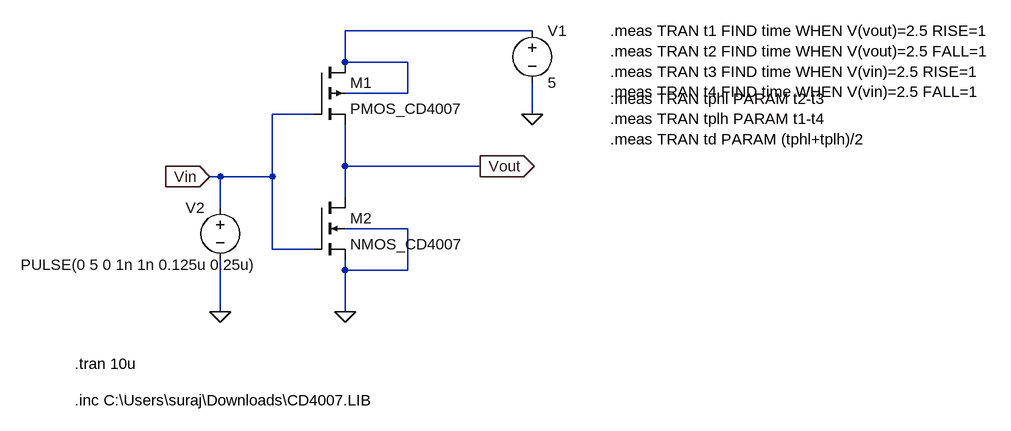
[diagram p0: schematic CD4007_INVERTER.asc]
CD4007_INVERTER.asc, the LTspice schematic file:
Version 4
SHEET 1 1072 680
WIRE 464 16 176 16
WIRE 176 64 176 16
WIRE 272 64 176 64
WIRE 272 112 272 64
WIRE 272 112 176 112
WIRE 128 144 64 144
WIRE 464 144 464 96
WIRE 176 224 176 160
WIRE 384 224 176 224
WIRE -16 240 -32 240
WIRE 64 240 64 144
WIRE 64 240 -16 240
WIRE 176 272 176 224
WIRE -16 288 -16 240
WIRE 272 320 176 320
WIRE 64 352 64 240
WIRE 128 352 64 352
WIRE 176 384 176 368
WIRE 272 384 272 320
WIRE 272 384 176 384
WIRE -16 448 -16 368
WIRE 176 448 176 384
FLAG 176 448 0
FLAG 384 224 Vout
IOPIN 384 224 Out
FLAG 464 144 0
FLAG -32 240 Vin
IOPIN -32 240 In
FLAG -16 448 0
SYMBOL pmos4 128 64 R0
SYMATTR InstName M1
SYMATTR Value PMOS_CD4007
SYMATTR Value2 l=5u w=360u
SYMBOL nmos4 128 272 R0
SYMATTR InstName M2
SYMATTR Value NMOS_CD4007
SYMATTR Value2 l=5u w=170u
SYMBOL voltage 464 0 R0
WINDOW 123 0 0 Left 0
WINDOW 39 0 0 Left 0
SYMATTR InstName V1
SYMATTR Value 5
SYMBOL voltage -16 272 M0
WINDOW 3 307 104 Right 2
WINDOW 123 0 0 Left 0
WINDOW 39 0 0 Left 0
SYMATTR Value PULSE(0 5 0 1n 1n 0.125u 0.25u)
SYMATTR InstName V2
TEXT -240 584 Left 2 !.inc C:\\Users\\suraj\\Downloads\\CD4007.LIB
TEXT 584 16 Left 2 !.meas TRAN t1 FIND time WHEN V(vout)=2.5 RISE=1\n.meas TRAN t2 FIND time WHEN V(vout)=2.5 FALL=1\n.meas TRAN t3 FIND time WHEN V(vin)=2.5 RISE=1\n.meas TRAN t4 FIND time WHEN V(vin)=2.5 FALL=1
TEXT 584 120 Left 2 !.meas TRAN tphl PARAM t2-t3\n.meas TRAN tplh PARAM t1-t4\n.meas TRAN td PARAM (tphl+tplh)/2
TEXT -240 528 Left 2 !.tran 10u

The netlist it stands for:
* CD4007_INVERTER.asc
M1 N001 Vin Vout N001 PMOS_CD4007 l=5u w=360u
M2 Vout Vin 0 0 NMOS_CD4007 l=5u w=170u
V1 N001 0 5
V2 Vin 0 PULSE(0 5 0 1n 1n 0.125u 0.25u)
.model NMOS NMOS
.model PMOS PMOS
.lib standard.mos
.inc C:\Users\suraj\Downloads\CD4007.LIB
.meas TRAN t1 FIND time WHEN V(vout)=2.5 RISE=1
.meas TRAN t2 FIND time WHEN V(vout)=2.5 FALL=1
.meas TRAN t3 FIND time WHEN V(vin)=2.5 RISE=1
.meas TRAN t4 FIND time WHEN V(vin)=2.5 FALL=1
.meas TRAN tphl PARAM t2-t3
.meas TRAN tplh PARAM t1-t4
.meas TRAN td PARAM (tphl+tplh)/2
.tran 10u
.backanno
.end